# Altium schematic sheet USBCharger.SchDoc
size A3; DocumentNumber: 9; SheetNumber: 9; SheetTotal: 9
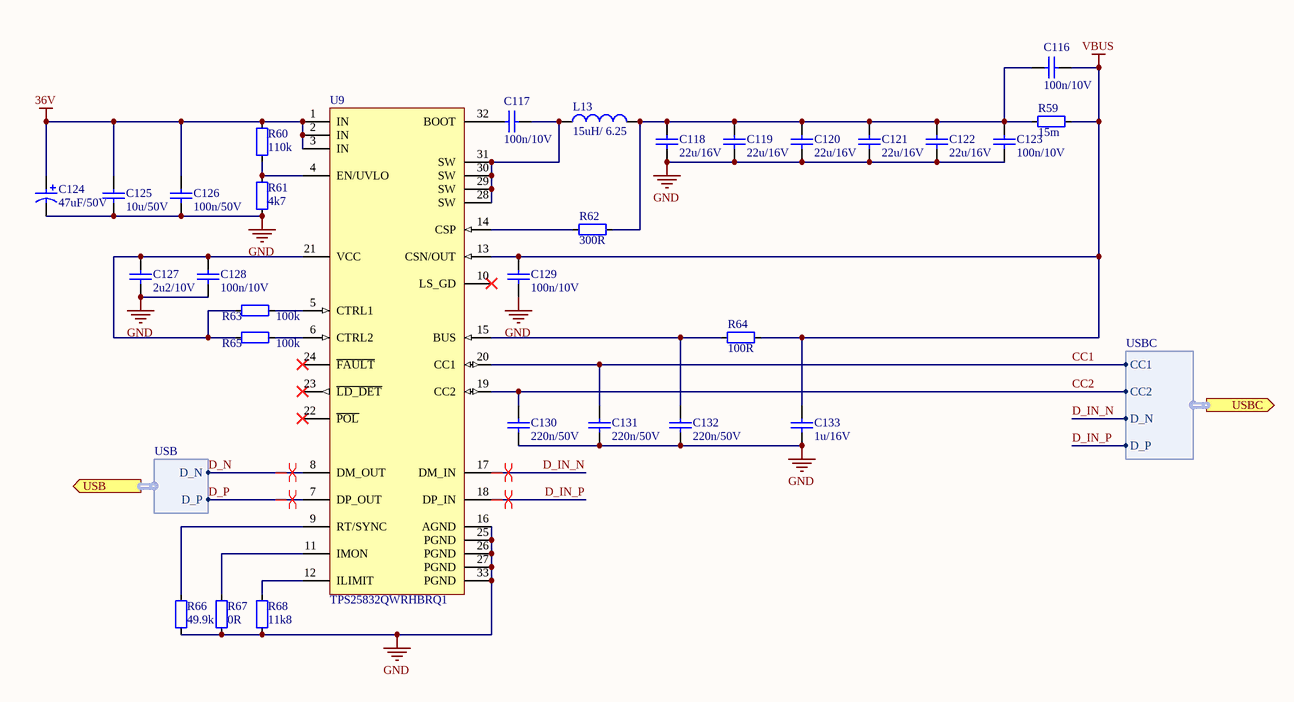
[diagram p0: USBCharger.SchDoc]

## Parts
C116  100n/10V  [C0402]
C117  100n/10V  [C0402]
C118  22u/16V  [C1210]
C119  22u/16V  [C1210]
C120  22u/16V  [C1210]
C121  22u/16V  [C1210]
C122  22u/16V  [C1210]
C123  100n/10V  [C0402]
C124  47uF/50V  [WURTH-L6.5-D8]
C125  10u/50V  [C1210]
C126  100n/50V  [C0603]
C127  2u2/10V  [C0603]
C128  100n/10V  [C0402]
C129  100n/10V  [C0402]
C130  220n/50V  [C0603]
C131  220n/50V  [C0603]
C132  220n/50V  [C0603]
C133  1u/16V  [C0603]
L13  15uH/ 6.25  [PA4342.XXXNLT]
R59  15m  [R1206]
R60  110k  [R0402]
R61  4k7  [R0402]
R62  300R  [R0402]
R63  100k  [R0402]
R64  100R  [R0402]
R65  100k  [R0402]
R66  49.9k  [R0402]
R67  0R  [R0402]
R68  11k8  [R0402]
U9  TPS25832QWRHBRQ1  [VQFN-32]

## Ports
USB (out, harness USB), USBC (out, harness USBC)

## Harnesses
USBC: CC1, CC2, D_N, D_P
USB: D_N, D_P

## Nets
36V: C124.1 C125.2 C126.2 R60.2 U9.1(IN) U9.2(IN) U9.3(IN)
GND: C118.1 C119.1 C120.1 C121.1 C122.1 C123.1 C124.2 C125.1 C126.1 C127.1 C128.1 C129.1 C130.1 C131.1 C132.1 C133.1 R61.1 R66.1 R67.1 R68.1 U9.16(AGND) U9.25(PGND) U9.26(PGND) U9.27(PGND) U9.33(PGND)
VBUS: C116.2 C129.2 C133.2 R59.2 R64.2 U9.13(CSN/OUT)
CC1: C131.2 U9.20(CC1) ; port USBC.CC1
CC2: C130.2 U9.19(CC2) ; port USBC.CC2
D_IN_N: U9.17(DM_IN) ; port USBC.D_N
D_IN_P: U9.18(DP_IN) ; port USBC.D_P
D_N: U9.8(DM_OUT) ; port USB.D_N
D_P: U9.7(DP_OUT) ; port USB.D_P
NetC116_1: C116.1 C118.2 C119.2 C120.2 C121.2 C122.2 C123.2 L13.2 R59.1 R62.2
NetC117_1: C117.1 U9.32(BOOT)
NetC117_2: C117.2 L13.1 U9.28(SW) U9.29(SW) U9.30(SW) U9.31(SW)
NetC127_2: C127.2 C128.2 R63.1 R65.1 U9.21(VCC)
NetC132_2: C132.2 R64.1 U9.15(BUS)
NetR60_1: R60.1 R61.2 U9.4(EN/UVLO)
NetR62_1: R62.1 U9.14(CSP)
NetR63_2: R63.2 U9.5(CTRL1)
NetR65_2: R65.2 U9.6(CTRL2)
NetR66_2: R66.2 U9.9(RT/SYNC)
NetR67_2: R67.2 U9.11(IMON)
NetR68_2: R68.2 U9.12(ILIMIT)

Not connected (* = marked no-connect by the designer): U9 10(LS_GD)* 22(~{POL})* 23(~{LD_DET})* 24(~{FAULT})*

## Layout directives
differential pair: D_IN_N, D_IN_P, D_N, D_P

## Notes on the sheet
- Title
- Date:
- Number:
- Revision:
- Sheet
- of
- File:
- Author

## Library data of the parts
C116 C117 C123 C128 C129 = 100n 10V X5R 0402: Manufacturer Part Number 1: 885012105010; Manufacturer 1: Wurth Elektronik; Voltage: 10V; Tolerance: 20%; Specifications: X5R 100n 10V ±20%; Capacitance: 100n; Dielectric: X5R; Supplier 1: Mouser; Supplier Part Number 1: 710-885012105010
C118-C122 = 22u 16V X7R 1210: Manufacturer Part Number 1: GCM32ER71C226ME19K; Manufacturer 1: Murata; Voltage: 16V; Tolerance: 20%; Specifications: X7R 22u 16V ±20%; Capacitance: 22u; Dielectric: X7R; Supplier 1: Mouser; Supplier Part Number 1: 81-GCM32ER71C226ME9K
C124 = Wurth-47uF-50V-L6.5-D8: Aluminium Electrolytic Capacitors - SMD WCAP-ASLI 50V 47uF 20% ESR=690mOhms; Manufacturer Part Number 1: 865080649013; Manufacturer 1: Wurth Elektronik; Specifications: 47uF 50V ±20%; ComponentLink1Description: Datasheet; ComponentLink1URL: https://www.mouser.co.uk/datasheet/2/445/865080649013-1075240.pdf; Capacitance: 47uF; Voltage: 50V; Tolerance: 20%; Supplier 1: Mouser; Supplier Part Number 1: 710-865080649013
C125 = 10u 50V X5R 1210: Manufacturer Part Number 1: UMK325BJ106KM-T; Manufacturer 1: TAIYO YUDEN; Voltage: 50V; Tolerance: 10%; Specifications: X5R 10u 50V ±10%; Capacitance: 10u; Dielectric: X5R; Supplier 1: Farnell; Supplier Part Number 1: 2113078
C126 = 100n 50V X7R 0603: Manufacturer Part Number 1: C0603C104M5RACTU; Manufacturer 1: KEMET; Voltage: 50V; Tolerance: 20%; Specifications: X7R 100n 50V ±20%; Capacitance: 100n; Dielectric: X7R; Supplier 1: Mouser; Supplier Part Number 1: 80-C0603C104M5R
C127 = 2u2 10V X5R 0603: Manufacturer Part Number 1: CL10A225KP8NNNC; Manufacturer 1: SAMSUNG ELECTRO-MECHANICS; Voltage: 10V; Tolerance: 10%; Specifications: X5R 2u2 10V ±10%; Capacitance: 2u2; Dielectric: X5R; Supplier 1: Farnell; Supplier Part Number 1: 3013393
C130-C132 = 220n 50V X7R 0603: Manufacturer Part Number 1: GCM188R71H224KA64D; Manufacturer 1: MURATA; Voltage: 50V; Tolerance: 10%; Specifications: X7R 220n 50V ±10%; Capacitance: 220n; Dielectric: X7R; Supplier 1: Farnell; Supplier Part Number 1: 2456085
C133 = 1u 16V X7R 0603: Manufacturer Part Number 1: 885012206052; Manufacturer 1: Wurth Elektronik; Voltage: 16V; Tolerance: 10%; Specifications: X7R 1u 16V ±10%; Capacitance: 1u; Dielectric: X7R; Supplier 1: Mouser; Supplier Part Number 1: 710-885012206052
L13 = PA4342.153NLT: Fixed Inductors 15uH 6.25A 4mm 20% Low Prof; Manufacturer 1: Pulse Electronics; Current: 6.25; Specifications: 15uH 6.25 20%; ComponentLink1Description: Datasheet; Inductance: 15uH; Tolerance: 20%; Manufacturer Part Number 1: PA4342.153NLT; Supplier 1: Mouser; Supplier Part Number 1: 673-PA4342.153NLT
R59 = 15m 1W 100V 1206: Manufacturer Part Number 1: WW12RR015FTL; Manufacturer 1: WALSIN; Power Rating: 1W; Tolerance: 1%; Voltage: 100V; Resistance: 15m; Specifications: =Resistance+ ' '+"Power Rating "+Voltage+' ±'+Tolerance; Supplier 1: Farnell; Supplier Part Number 1: 2503045
R60 = 110k 63mW 50V 0402: Manufacturer Part Number 1: MCWR04X1103FTL; Manufacturer 1: MULTICOMP PRO; Power Rating: 63W; Tolerance: 1%; Voltage: 50V; Resistance: 110k; Specifications: =Resistance+ ' '+"Power Rating "+Voltage+' ±'+Tolerance; Supplier 1: Farnell; Supplier Part Number 1: 2447099
R61 = 4k7 63mW 50V 0402: Manufacturer Part Number 1: AC0402FR-134K7L; Manufacturer 1: Yageo; Power Rating: 63mW; Tolerance: 1%; Voltage: 50V; Resistance: 4k7; Specifications: =Resistance+ ' '+"Power Rating "+Voltage+' ±'+Tolerance; Supplier 1: Mouser; Supplier Part Number 1: 603-AC0402FR-134K7L
R62 = 300R 63mW 50V 0402: Manufacturer Part Number 1: MCMR04X3000FTL; Manufacturer 1: MULTICOMP PRO; Power Rating: 63mW; Tolerance: 1%; Voltage: 50V; Resistance: 300R; Specifications: =Resistance+ ' '+"Power Rating "+Voltage+' ±'+Tolerance; Supplier 1: Farnell; Supplier Part Number 1: 2072893
R63 R65 = 100k 63mW 50V 0402: Manufacturer Part Number 1: AC0402FR-07100KL; Manufacturer 1: Yageo; Power Rating: 63mW; Tolerance: 1%; Voltage: 50V; Resistance: 100k; Specifications: =Resistance+ ' '+"Power Rating "+Voltage+' ±'+Tolerance; Supplier 1: Mouser; Supplier Part Number 1: 603-AC0402FR-07100KL
R64 = 100R 63mW 50V 0402: Manufacturer Part Number 1: MCWR04X1000FTL; Manufacturer 1: MULTICOMP PRO; Power Rating: 63mW; Tolerance: 1%; Voltage: 50V; Resistance: 100R; Specifications: =Resistance+ ' '+"Power Rating "+Voltage+' ±'+Tolerance; Supplier 1: Farnell; Supplier Part Number 1: 2447095
R66 = 49k9 63mW 50V 0402: Manufacturer Part Number 1: CRCW040249K9FKEDC; Manufacturer 1: Vishay; Power Rating: 63mW; Tolerance: 1%; Voltage: 50V; Resistance: 49.9k; Specifications: =Resistance+ ' '+"Power Rating "+Voltage+' ±'+Tolerance; Supplier 1: Mouser; Supplier Part Number 1: 71-CRCW040249K9FKEDC
R67 = 0R 63mW 50V 0402: Manufacturer Part Number 1: CRCW04020000Z0EDC; Manufacturer 1: Vishay; Power Rating: 63mW; Tolerance: 1%; Voltage: 50V; Resistance: 0R; Specifications: =Resistance+ ' '+"Power Rating "+Voltage+' ±'+Tolerance; Supplier 1: Mouser; Supplier Part Number 1: 71-CRCW04020000Z0EDC
R68 = 11k8 63mW 50V 0402: Manufacturer Part Number 1: MCWR04X1182FTL; Manufacturer 1: MULTICOMP PRO; Power Rating: 63mW; Tolerance: 1%; Voltage: 50V; Resistance: 11k8; Specifications: =Resistance+ ' '+"Power Rating "+Voltage+' ±'+Tolerance; Supplier 1: Farnell; Supplier Part Number 1: 2694536
U9 = TPS25832QWRHBRQ1: USB Interface IC USB Type-C and SDP/CDP charge port converter with cable compensation 32-VQFN -40 to 125; Manufacturer 1: Texas Instruments; Manufacturer Part Number 1: TPS25832QWRHBRQ1; Supplier 1: Mouser; Supplier Part Number 1: 595-TPS25832QWRHBRQ1; ComponentLink1Description: Datasheet; ComponentLink1URL: https://www.ti.com/lit/ds/symlink/tps25832-q1.pdf; Supplier 2: Mouser; Supplier Part Number 2: 595-PS25832AQWRHBRQ1